# Altium schematic sheet DSA.SchDoc: DSA
size Legal; CheckedBy: J. Brinton; CompanyName: Signal Laboratories, Inc.; DrawnBy: J. Brinton; Engineer: J. Brinton; Address1: 3479 Edison Way; Address2: Menlo Park CA 94025; Address3: +1 (877) 778-8435; Address4: siglabs.com; DocumentNumber: 50; Revision: 2b; SheetNumber: 51; SheetTotal: 58
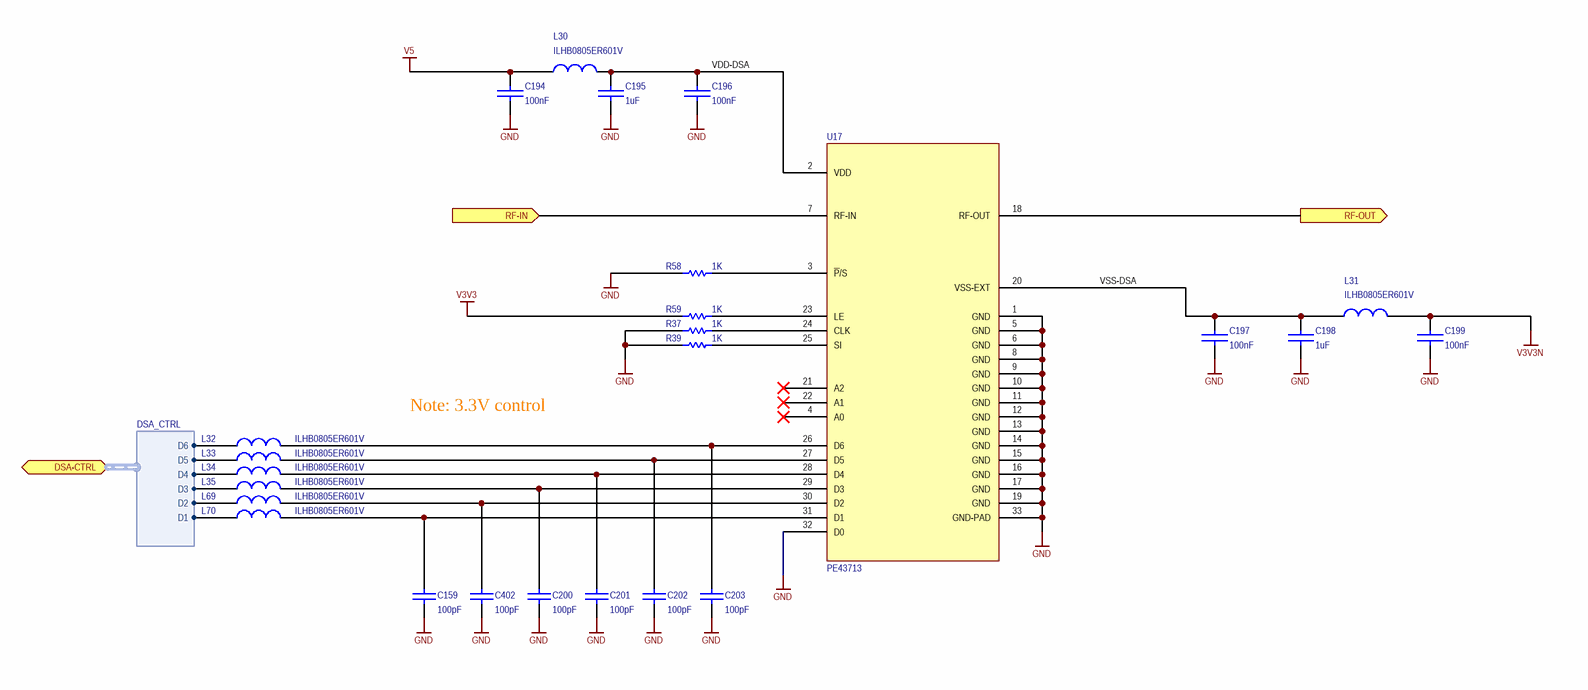
[diagram p0: DSA.SchDoc]

## Parts
C159  value 100pF  [0402]  (hidden comment: CBR04C101F3GAC)
C194  value 100nF  [0402]  (hidden comment: GRM155R71C104KA88J)
C195  value 1uF  [0402]  (hidden comment: GRM155R61A105KE15D)
C196  value 100nF  [0402]  (hidden comment: GRM155R71C104KA88J)
C197  value 100nF  [0402]  (hidden comment: GRM155R71C104KA88J)
C198  value 1uF  [0402]  (hidden comment: GRM155R61A105KE15D)
C199  value 100nF  [0402]  (hidden comment: GRM155R71C104KA88J)
C200  value 100pF  [0402]  (hidden comment: CBR04C101F3GAC)
C201  value 100pF  [0402]  (hidden comment: CBR04C101F3GAC)
C202  value 100pF  [0402]  (hidden comment: CBR04C101F3GAC)
C203  value 100pF  [0402]  (hidden comment: CBR04C101F3GAC)
C402  value 100pF  [0402]  (hidden comment: CBR04C101F3GAC)
L30  ILHB0805ER601V  [0805]
L31  ILHB0805ER601V  [0805]
L32  ILHB0805ER601V  [0805]
L33  ILHB0805ER601V  [0805]
L34  ILHB0805ER601V  [0805]
L35  ILHB0805ER601V  [0805]
L69  ILHB0805ER601V  [0805]
L70  ILHB0805ER601V  [0805]
R37  value 1K  [0402]  (hidden comment: RC0402FR-071KL)
R39  value 1K  [0402]  (hidden comment: RC0402FR-071KL)
R58  value 1K  [0402]  (hidden comment: RC0402FR-071KL)
R59  value 1K  [0402]  (hidden comment: RC0402FR-071KL)
U17  PE43713  [QFN-PE-32]

## Ports
DSA-CTRL (harness DSA_CTRL), RF-IN (in), RF-OUT (out)

## Harnesses
DSA_CTRL: D3, D4, D5, D6, D2, D1

## Nets
GND: C159.2 C194.1 C195.1 C196.1 C197.1 C198.1 C199.1 C200.2 C201.2 C202.2 C203.2 C402.2 R37.1 R39.1 R58.1 U17.1(GND) U17.5(GND) U17.6(GND) U17.8(GND) U17.9(GND) U17.10(GND) U17.11(GND) U17.12(GND) U17.13(GND) U17.14(GND) U17.15(GND) U17.16(GND) U17.17(GND) U17.19(GND) U17.32(D0) U17.33(GND-PAD)
V3V3: R59.1
V3V3N: C199.2 L31.2
V5: C194.2 L30.2
RF-IN: U17.7(RF-IN) ; port RF-IN
RF-OUT: U17.18(RF-OUT) ; port RF-OUT
VDD-DSA: C195.2 C196.2 L30.1 U17.2(VDD)
VSS-DSA: C197.2 C198.2 L31.1 U17.20(VSS-EXT)
NetC159_1: C159.1 L70.1 U17.31(D1)
NetC200_1: C200.1 L35.1 U17.29(D3)
NetC201_1: C201.1 L34.1 U17.28(D4)
NetC202_1: C202.1 L33.1 U17.27(D5)
NetC203_1: C203.1 L32.1 U17.26(D6)
NetC402_1: C402.1 L69.1 U17.30(D2)
NetL32_2: L32.2 ; port DSA-CTRL.D6
NetL33_2: L33.2 ; port DSA-CTRL.D5
NetL34_2: L34.2 ; port DSA-CTRL.D4
NetL35_2: L35.2 ; port DSA-CTRL.D3
NetL69_2: L69.2 ; port DSA-CTRL.D2
NetL70_2: L70.2 ; port DSA-CTRL.D1
NetR37_2: R37.2 U17.24(CLK)
NetR39_2: R39.2 U17.25(SI)
NetR58_2: R58.2 U17.3(~{P}/S)
NetR59_2: R59.2 U17.23(LE)

Not connected (* = marked no-connect by the designer): U17 4(A0)* 21(A2)* 22(A1)*

## Notes on the sheet
- Note: 3.3V control
- Title
- Engineer
- Revision
- Drawn By
- Checked By
- Date
- Sheet
- of

## Library data of the parts
C159 C200-C203 C402 = CAP 0402: Ceramic Capacitor 100pF ±1% 25V NP0 0402; Manufacturer: Kemet; Tr: -55:125; Voltage: 25V; Manufacturer P/N: CBR04C101F3GAC; Package: 0402; Tolerance: ±1%
C194 C196 C197 C199 = CAP: Ceramic Capacitor 100nF ±10% 16V X7R 0402; Manufacturer: Murata; Tr: -55:125; Manufacturer P/N: GRM155R71C104KA88J; Voltage: 16V; Package: 0402; Tolerance: ±10%
C195 C198 = CAP: Ceramic Capacitor 1uF ±10% 10V X5R 0402; Manufacturer: Murata; Tr: -55:125; Manufacturer P/N: GRM155R61A105KE15D; Package: 0402; Tolerance: ±10%; Voltage: 10V
L30-L35 L69 L70 = INDUCTANCE1: Ferrite Bead 600-Ohm @ 100MHz 2A 0805; Manufacturer: Vishay Dale; Value: 600@100MHz; Tolerance: ±25%; Tr: -55:125; Manufacturer P/N: ILHB0805ER601V; Package: 0805
R37 R39 R58 R59 = RES 0402: Thick Film Resistor 1k ±1% 0402; Manufacturer: Yageo; Tr: -55:155; Package: 0402; Manufacturer P/N: RC0402FR-071KL; Do Not Place: *; Tolerance: ±1%
U17 = PE43713: Digital Step Attenuaator, 9kHz-6GHz; Manufacturer: Peregrine Semiconductor; Manufacturer P/N: PE43713